# EAGLE design board_v2 (EAGLE 9.0.0)
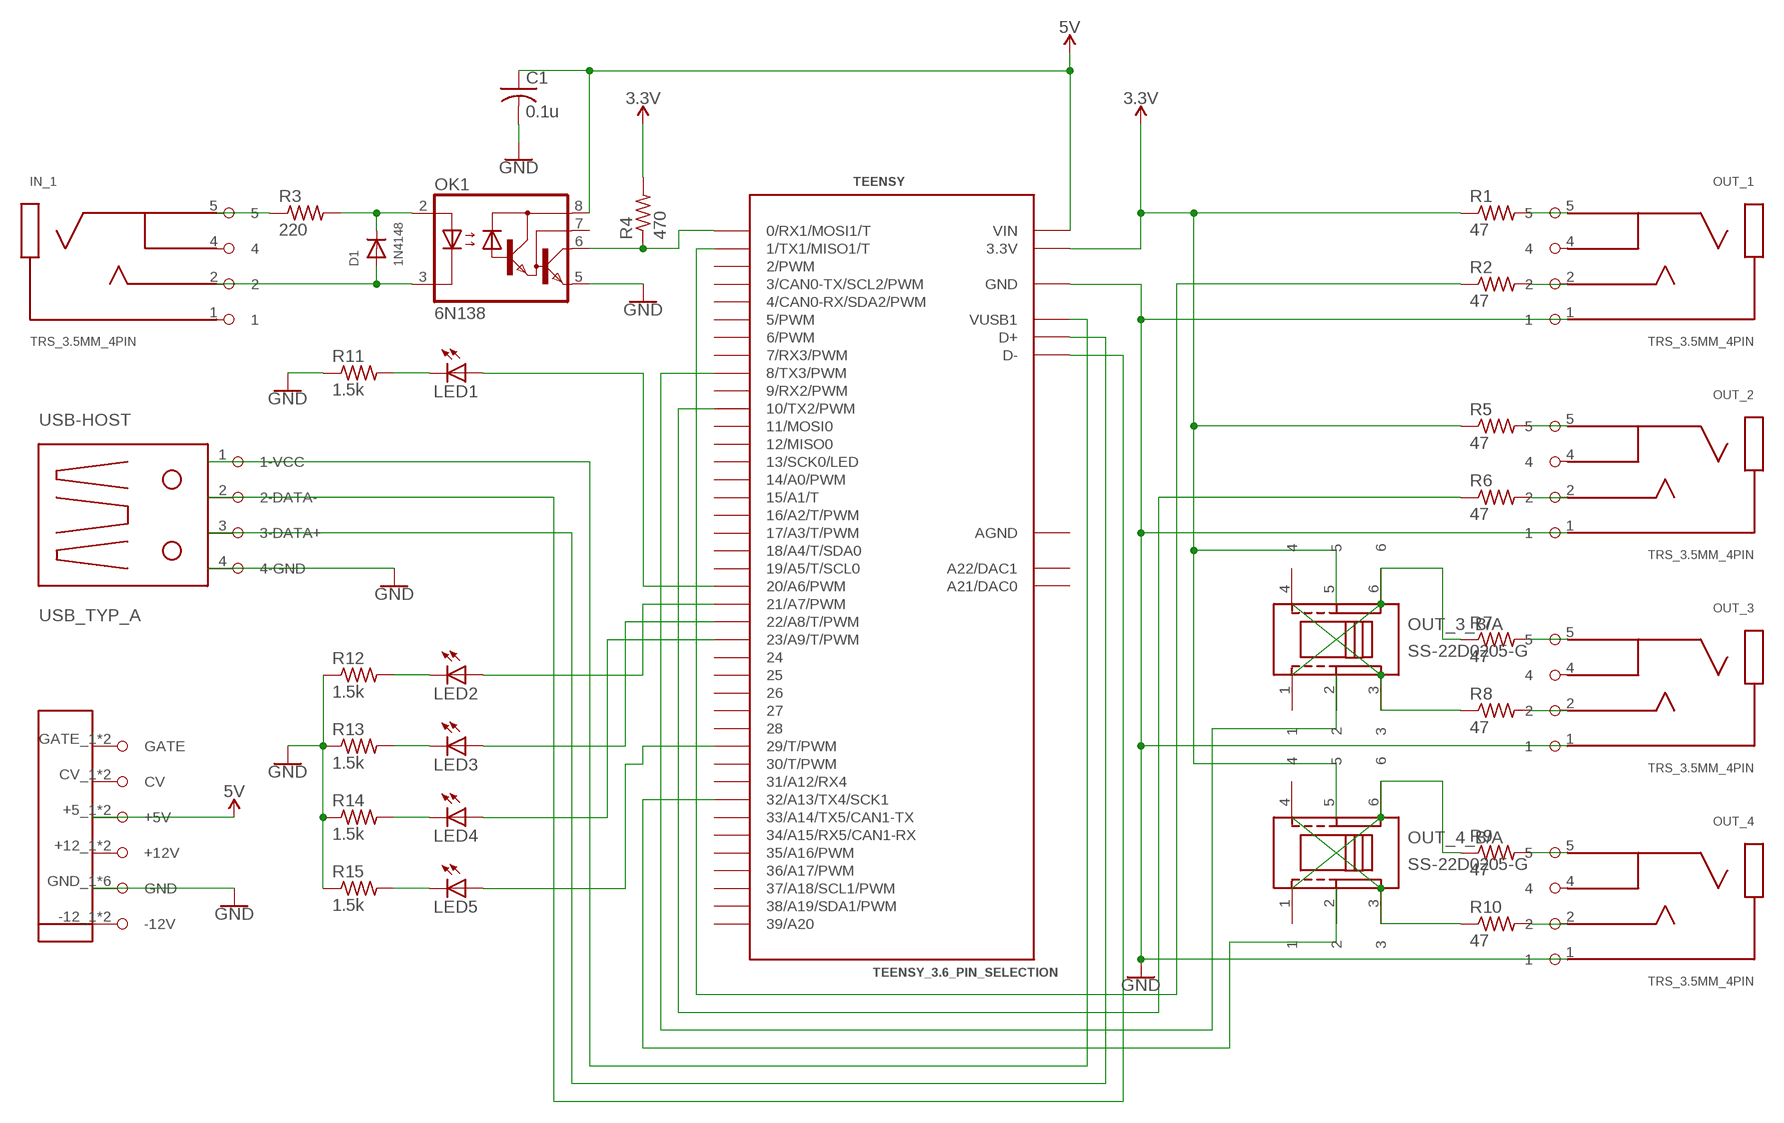
[diagram p0: schematic, sheet 1]

## Parts
C1  0.1u  C-USC0805  [C0805]
D1  1N4148  DIODEDO-1N4148  [DO-1N4148]
IN_1  TRS_3.5MM_4PIN  [FC681374V]
LED1  LED3MM  [LED3MM]
LED2  LED3MM  [LED3MM]
LED3  LED3MM  [LED3MM]
LED4  LED3MM  [LED3MM]
LED5  LED3MM  [LED3MM]
OK1  6N138  [DIL08]
OUT_1  TRS_3.5MM_4PIN  [FC681374V]
OUT_2  TRS_3.5MM_4PIN  [FC681374V]
OUT_3  TRS_3.5MM_4PIN  [FC681374V]
OUT_3_B/A  SS-22D0205-G  [SS-22D0205-G]
OUT_4  TRS_3.5MM_4PIN  [FC681374V]
OUT_4_B/A  SS-22D0205-G  [SS-22D0205-G]
POWER  EURORACK_POWER_16  [EURORACK_POWER_16]
R1  47  R-US_R0805  [R0805]
R2  47  R-US_R0805  [R0805]
R3  220  R-US_R0805  [R0805]
R4  470  R-US_R0805  [R0805]
R5  47  R-US_R0805  [R0805]
R6  47  R-US_R0805  [R0805]
R7  47  R-US_R0805  [R0805]
R8  47  R-US_R0805  [R0805]
R9  47  R-US_R0805  [R0805]
R10  47  R-US_R0805  [R0805]
R11  1.5k  R-US_R0805  [R0805]
R12  1.5k  R-US_R0805  [R0805]
R13  1.5k  R-US_R0805  [R0805]
R14  1.5k  R-US_R0805  [R0805]
R15  1.5k  R-US_R0805  [R0805]
TEENSY  TEENSY_3.6_PIN_SELECTION  [TEENSY_3.6_PIN_SELECTION]
USB-HOST  USB_TYP_A  [USB_HOST_VERTICAL]

## Nets
3.3V: OUT_3_B/A.5 OUT_4_B/A.5 R1.1 R4.2 R5.1 TEENSY.3.3V TEENSY.3.3V3(3.3V)
5V: C1.1 OK1.8(VCC) POWER.+5_1(+5V) POWER.+5_2(+5V) TEENSY.VIN
GND: C1.2 OK1.5(GND) OUT_1.1 OUT_2.1 OUT_3.1 OUT_4.1 POWER.GND_1(GND) POWER.GND_2(GND) POWER.GND_3(GND) POWER.GND_4(GND) POWER.GND_5(GND) POWER.GND_6(GND) R11.1 R12.1 R13.1 R14.1 R15.1 TEENSY.GND TEENSY.GND1(GND) TEENSY.GND3(GND) TEENSY.GND4(GND) USB-HOST.4(4-GND)
N$1: OK1.6(VO) R4.1 TEENSY.0(0/RX1/MOSI1/T)
N$2: D1.C OK1.2(A) R3.2
N$3: D1.A IN_1.2 OK1.3(C)
N$4: TEENSY.VUSB1 USB-HOST.1(1-VCC)
N$5: R2.1 TEENSY.1(1/TX1/MISO1/T)
N$6: OUT_1.2 R2.2
N$7: OUT_1.5 R1.2
N$8: OUT_3.2 R8.2
N$9: IN_1.5 R3.1
N$10: OUT_2.2 R6.2
N$11: OUT_2.5 R5.2
N$12: OUT_3.5 R7.2
N$13: OUT_4.2 R10.2
N$14: OUT_4.5 R9.2
N$15: TEENSY.D+ USB-HOST.3(3-DATA+)
N$16: TEENSY.D- USB-HOST.2(2-DATA-)
N$17: LED1.K(C) R11.2
N$18: R6.1 TEENSY.10(10/TX2/PWM)
N$19: OUT_3_B/A.2 TEENSY.8(8/TX3/PWM)
N$20: OUT_4_B/A.2 TEENSY.32/A13(32/A13/TX4/SCK1)
N$21: OUT_4_B/A.3 OUT_4_B/A.4 R10.1
N$22: LED1.A TEENSY.20/A6(20/A6/PWM)
N$23: OUT_4_B/A.1 OUT_4_B/A.6 R9.1
N$24: OUT_3_B/A.1 OUT_3_B/A.6 R7.1
N$25: OUT_3_B/A.3 OUT_3_B/A.4 R8.1
N$26: LED5.K(C) R15.2
N$27: LED2.K(C) R12.2
N$28: LED3.K(C) R13.2
N$29: LED4.K(C) R14.2
N$30: LED2.A TEENSY.21/A7(21/A7/PWM)
N$31: LED3.A TEENSY.22/A8(22/A8/T/PWM)
N$32: LED4.A TEENSY.23/A9(23/A9/T/PWM)
N$33: LED5.A TEENSY.29(29/T/PWM)
Unconnected: IN_1.1 IN_1.4 OK1.7(VB) OUT_1.4 OUT_2.4 OUT_3.4 OUT_4.4 POWER.+12_1(+12V) POWER.+12_2(+12V) POWER.-12_1(-12V) POWER.-12_2(-12V) POWER.CV_1(CV) POWER.CV_2(CV) POWER.GATE_1(GATE) POWER.GATE_2(GATE) TEENSY.2(2/PWM) TEENSY.3(3/CAN0-TX/SCL2/PWM) TEENSY.4(4/CAN0-RX/SDA2/PWM) TEENSY.5(5/PWM) TEENSY.6(6/PWM) TEENSY.7(7/RX3/PWM) TEENSY.9(9/RX2/PWM) TEENSY.11(11/MOSI0) TEENSY.12(12/MISO0) TEENSY.13(13/SCK0/LED) TEENSY.14/A0(14/A0/PWM) TEENSY.15/A1(15/A1/T) TEENSY.16/A2(16/A2/T/PWM) TEENSY.17/A3(17/A3/T/PWM) TEENSY.18/A4(18/A4/T/SDA0) TEENSY.19/A5(19/A5/T/SCL0) TEENSY.24 TEENSY.25 TEENSY.26 TEENSY.27 TEENSY.28 TEENSY.30(30/T/PWM) TEENSY.31/A12(31/A12/RX4) TEENSY.33/A14(33/A14/TX5/CAN1-TX) TEENSY.34/A15(34/A15/RX5/CAN1-RX) TEENSY.35/A16(35/A16/PWM) TEENSY.36/A17(36/A17/PWM) TEENSY.37/A18(37/A18/SCL1/PWM) TEENSY.38/A19(38/A19/SDA1/PWM) TEENSY.39/A20 TEENSY.A21(A21/DAC0) TEENSY.A22(A22/DAC1)

## Power pins joined to a net without a drawn wire
AGND: TEENSY.AGND

## Library data of the parts
C1 = adafruit:C-US: CAPACITOR, American symbol
D1 = adafruit:DIODE: Diode SMADIODE - SMA Surface Mount Package 20V 1A Schottky Diode Digikey: 641-1014-6-ND DO-1N4148 - Through Hole Small Current Diode SOD-123 20V 1 A (.5mV Vf) Schottky Diode - Digikey: MBRX120TPMSCT-ND SOD-323 10V 570mA (.38mV Vf, 3ns) Schottky Diode - Digikey: ZLLS410CT-ND SOD-523 30V 30mA Schottky Diode (RB751S-40TE61) - Digikey: RB751S-40TE61CT-ND SOT23-R/W - SOT23 Package (R = Solder Paste/Reflow Ovens, W = Hand-Soldering) BAT54Film 40V 300mA - Digikey: 497-7162-1-ND
IN_1 OUT_1-OUT_4 = beat_lbr:TRS_3.5MM_4PIN
LED1-LED5 = adafruit:LED: LED OSRAM: - CHIPLED LG R971, LG N971, LY N971, LG Q971, LY Q971, LO R971, LY R971 LH N974, LH R974 LS Q976, LO Q976, LY Q976 LO Q996 - Hyper CHIPLED LW Q18S LB Q993, LB Q99A, LB R99A - SideLED LS A670, LO A670, LY A670, LG A670, LP A670 LB A673, LV A673, LT A673, LW A673 LH A674 LY A675 LS A676, LA A676, LO A676, LY A676, LW A676 LS A679, LY A679, LG A679 - Hyper Micro SIDELED® LS Y876, LA Y876, LO Y876, LY Y876 LT Y87S - SmartLED LW L88C, LW L88S LB L89C, LB L89S, LG L890 LS L89K, LO L89K, LY L89K LS L896, LA L896, LO L896, LY L896 - TOPLED LS T670, LO T670, LY T670, LG T670, LP T670 LSG T670, LSP T670, LSY T670, LOP T670, LYG T670 LG T671, LOG T671, LSG T671 LB T673, LV T673, LT T673, LW T673 LH T674 LS T676, LA T676, LO T676, LY T676, LB T676, LH T676, LSB T676, LW T676 LB T67C, LV T67C, LT T67C, LS T67K, LO T67K, LY T67K, LW E67C LS E67B, LA E67B, LO E67B, LY E67B, LB E67C, LV E67C, LT E67C LW T67C LS T679, LY T679, LG T679 LS T770, LO T770, LY T770, LG T770, LP T770 LB T773, LV T773, LT T773, LW T773 LH T774 LS E675, LA E675, LY E675, LS T675 LS T776, LA T776, LO T776, LY T776, LB T776 LHGB T686 LT T68C, LB T68C - Hyper Mini TOPLED® LB M676 - Mini TOPLED Santana® LG M470 LS M47K, LO M47K, LY M47K Source: http://www.osram.convergy.de/
OK1 = optocoupler:6N138: MOTOROLA OPTO COUPLER; MF: VISHAY/TELEFUNKEN; MPN: 6N138; OC_FARNELL: 9860150; OC_NEWARK: 35K5294
OUT_3_B/A OUT_4_B/A = beat_lbr:SS-22D0205-G
POWER = beat_lbr:EURORACK_POWER_16
R1-R15 = adafruit:R-US_: RESISTOR, American symbol
TEENSY = Teensy_3_and_LC_Series_Boards_v1.4:TEENSY_3.6_PIN_SELECTION
USB-HOST = beat_lbr:USB_TYP_A

## Board
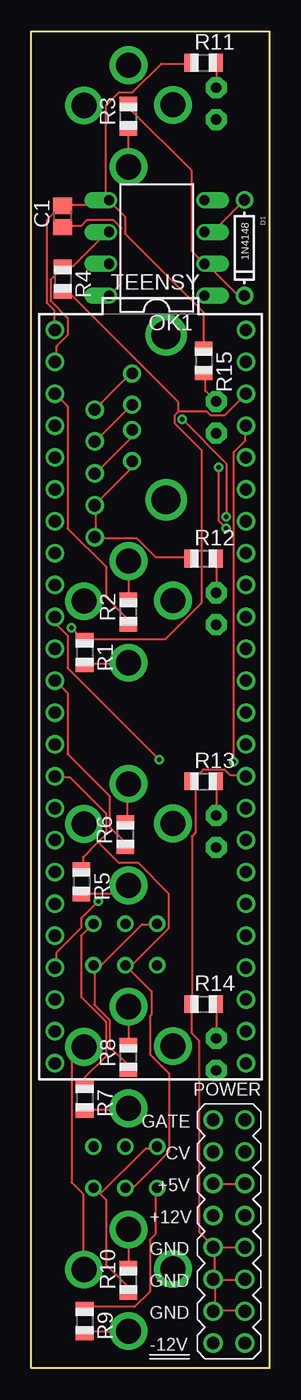
[diagram p1: board, top side]
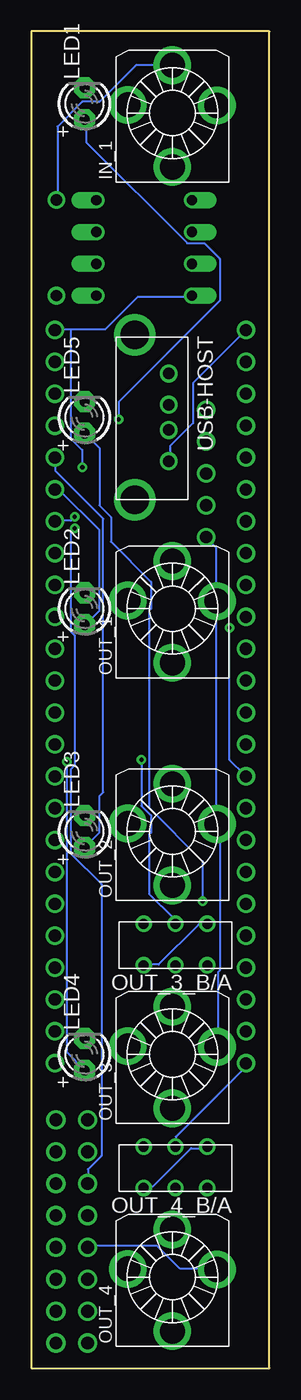
[diagram p2: board, bottom side, seen from below]

Size 19 x 106.5 mm. Coordinates in mm from the lower left corner, seen from the top.
Outline: 0,0 0,106.5 19,106.5 19,0 0,0
Copper layers (1*16): Top 0.035mm / dielectric 1.5mm / Bottom 0.035mm
Design rules "default": minimum track width 6mil, minimum drill 0.35mm, track to track 6mil, track to pad 6mil, pad to pad 6mil, via to via 6mil, smd to smd 6mil, copper to edge 40mil, drill to drill 6mil, minimum pad ring 10mil, minimum via ring 8mil, stop-mask expansion 4mil, vias tented up to drill 0mil, thermal gap 10mil

### Footprints (pad centres in the part's own frame; a part is rotated, then mirrored left to right if it is on the bottom)
C0805 = smd 1.3 x 1.5: 1 -0.85,0; 2 0.85,0
DO-1N4148 = drill 0.9: A -3.81,0; C 3.81,0
FC681374V = drill 2: 1 3.55,0.6; 2 0,3.8; 4 -3.55,0.65; 5 0,-4.3
LED3MM = drill 0.813 pad 1.676 octagon: A -1.27,0; K 1.27,0
DIL08 = drill 0.813 offset: 1 -3.81,-3.81; 2 -1.27,-3.81; 3 1.27,-3.81; 4 3.81,-3.81; 5 3.81,3.81; 6 1.27,3.81; 7 -1.27,3.81; 8 -3.81,3.81
SS-22D0205-G = drill 0.8: 1 -2.54,-1.65; 2 0,-1.65; 3 2.54,-1.65; 4 -2.54,1.65; 5 0,1.65; 6 2.54,1.65
EURORACK_POWER_16 = drill 1.02: +5_1 0,12.7; +5_2 2.54,12.7; +12_1 0,10.16; +12_2 2.54,10.16; -12_1 0,0; -12_2 2.54,0; CV_1 0,15.24; CV_2 2.54,15.24; GATE_1 0,17.78; GATE_2 2.54,17.78; GND_1 0,2.54; GND_2 2.54,2.54; GND_3 0,5.08; GND_4 2.54,5.08; GND_5 0,7.62; GND_6 2.54,7.62
R0805 = smd 1.1 x 1.4: 1 -1,0; 2 1,0
TEENSY_3.6_PIN_SELECTION = drill 0.965: 0 -7.62,25.4; 1 -7.62,22.86; 2 -7.62,20.32; 3 -7.62,17.78; 3.3V 7.62,22.86; 3.3V3 -7.62,-7.62; 4 -7.62,15.24; 5 -7.62,12.7; 6 -7.62,10.16; 7 -7.62,7.62; 8 -7.62,5.08; 9 -7.62,2.54; 10 -7.62,0; 11 -7.62,-2.54; 12 -7.62,-5.08; 13 7.62,-5.08; 14/A0 7.62,-2.54; 15/A1 7.62,0; 16/A2 7.62,2.54; 17/A3 7.62,5.08; 18/A4 7.62,7.62; 19/A5 7.62,10.16; 20/A6 7.62,12.7; 21/A7 7.62,15.24; 22/A8 7.62,17.78; 23/A9 7.62,20.32; 24 -7.62,-10.16; 25 -7.62,-12.7; 26 -7.62,-15.24; 27 -7.62,-17.78; 28 -7.62,-20.32; 29 -7.62,-22.86; 30 -7.62,-25.4; 31/A12 -7.62,-27.94; 32/A13 -7.62,-30.48; 33/A14 7.62,-30.48; 34/A15 7.62,-27.94; 35/A16 7.62,-25.4; 36/A17 7.62,-22.86; 37/A18 7.62,-20.32; 38/A19 7.62,-17.78; 39/A20 7.62,-15.24; A21 7.62,-12.7; A22 7.62,-10.16; AGND 7.62,25.4; D+ -4.445,16.51; D- -4.445,19.05; GND -7.62,27.94; GND1 7.62,-7.62; GND3 -4.445,13.97; GND4 -4.445,11.43; VIN 7.62,27.94; VUSB1 -4.445,21.59
USB_HOST_VERTICAL = drill 0.92: 1 -3.5,2.71; 2 -1,2.71; 3 1,2.71; 4 3.5,2.71 | drill 2.3: VIA1 -6.57,0; VIA2 6.57,0

### Placement (x,y rotation side)
C1  2.5,91.75 90 top
D1  17,89.25 270 top
IN_1  7.75,100 0 bottom
LED1  14.75,100.75 90 bottom
LED2  14.75,60.5 90 bottom
LED3  14.75,42.75 90 bottom
LED4  14.75,25 90 bottom
LED5  14.75,75.75 90 bottom
OK1  10,89.25 90 top
OUT_1  7.75,60.5 0 bottom
OUT_2  7.75,42.75 0 bottom
OUT_3  7.75,25 0 bottom
OUT_3_B/A  7.5,33.75 180 bottom
OUT_4  7.75,7.25 0 bottom
OUT_4_B/A  7.5,16 180 bottom
POWER  14.5,2 0 top
R1  4.25,57 270 top
R2  7.75,60.25 90 top
R3  7.75,99.75 90 top
R4  2.5,86.75 270 top
R5  4,38.75 270 top
R6  7.5,42.5 90 top
R7  4.25,21.5 270 top
R8  7.75,24.75 90 top
R9  4.25,3.75 270 top
R10  7.75,7 90 top
R11  13.75,104 0 top
R12  13.75,64.5 0 top
R13  13.75,46.75 0 top
R14  13.75,29 0 top
R15  13.75,80.25 270 top
TEENSY  9.5,54.77 0 top
USB-HOST  10.75,75.75 270 bottom

### Tracks (layer width: path | path; a pad name or v marks a point on that pad's centre or on a via)
3.3V  (via drill 0.35)
  Top 0.152: 11.73,76.2 11.43,75.89 11.43,75.29 13.56,73.15 13.56,60.96 10.67,58.06 4.27,58.06 R1.1 4.12,58.06 v3.2,58.98 | 11.73,76.2 14.02,76.2 14.33,75.89 15.39,75.89 17.07,77.57 TEENSY.3.3V | 11.73,76.2 11.73,76.96 3.05,85.65 2.59,85.65 R4.2 | 5.33,41.91 5.94,42.52 5.94,44.2 3.05,47.09 1.98,47.09 TEENSY.3.3V3 | 5.33,41.91 4.12,40.69 4.12,39.78 R5.1 | 7.77,31.85 7.62,32 OUT_3_B/A.5 7.77,31.85 | 7.77,31.85 9.6,30.02 9.6,28.19 9.45,28.04 9.45,24.99 10.97,23.47 10.97,17.22 8.23,14.48 7.62,14.48 OUT_4_B/A.5 | 5.33,41.91 7.01,40.23 8.53,40.23 10.97,37.8 10.97,35.05 7.77,31.85
  Bottom 0.152: v3.2,58.98 3.2,48.46 1.98,47.24 TEENSY.3.3V3
5V  (via drill 0.35)
  Top 0.152: POWER.+5_1 14.63,14.63 16.92,14.63 POWER.+5_2 | C1.1 2.59,90.98 3.96,90.98 4.42,91.44 6.55,91.44 7.16,90.83 7.16,86.41 6.25,85.5 OK1.8 | v15.54,66.9 14.94,67.51 v14.94,71.78
  Bottom 0.152: 15.85,82.75 13.11,82.75 10.52,85.34 6.25,85.34 OK1.8 | 15.85,82.75 17.07,82.75 TEENSY.VIN | v15.54,66.9 15.85,66.6 15.85,58.67 15.54,58.37 15.54,48.01 15.85,47.7 15.85,41 13.41,38.56 13.41,16.92 14.48,15.85 14.48,14.78 POWER.+5_1 | v14.94,71.78 14.94,73.15 15.85,74.07 15.85,82.75
GND
  Top 0.152: TEENSY.GND1 17.07,47.24 15.85,47.24 15.39,47.7 13.72,47.7 12.8,46.79 R13.1 12.8,46.63 13.11,46.33 13.11,42.67 12.8,42.37 12.8,29.11 R14.1 12.8,28.96 12.8,26.67 13.41,26.06 13.41,10.82 14.48,9.75 POWER.GND_5 14.63,9.6 | 14.63,9.6 16.92,9.6 POWER.GND_6 | 14.63,4.57 16.92,4.57 POWER.GND_2 | 14.63,7.01 16.92,7.01 POWER.GND_4 | 14.63,7.01 14.63,4.57 | 14.63,4.57 POWER.GND_1 | 14.63,7.01 POWER.GND_3 14.63,7.16 14.63,9.6 | USB-HOST.4 7.92,72.24 7.92,71.63 5.18,68.89 TEENSY.GND3 5.18,68.73 5.18,66.29 TEENSY.GND4 5.18,66.14 8.38,66.14 9.91,64.62 12.65,64.62 R12.1 | R15.1 13.72,81.38 13.72,84.12 7.47,90.37 7.47,91.75 6.25,92.96 OK1.5 | R11.1 12.65,103.94 10.36,103.94 8.08,101.65 7.01,101.65 5.94,100.58 5.94,93.27 6.1,93.12 OK1.5 | OK1.5 6.1,92.96 5.79,92.66 2.59,92.66 C1.2 2.44,92.66 1.22,91.44 1.22,84.89 1.83,84.28 1.83,82.75 TEENSY.GND | OUT_4.1 4.12,7.92 4.12,13.87 3.2,14.78 3.2,24.54 4.12,25.45 OUT_3.1
  Bottom 0.152: POWER.GND_5 14.48,9.75 8.99,9.75 7.16,7.92 4.27,7.92 OUT_4.1 | OUT_3.1 4.12,25.6 4.12,31.55 3.96,31.7 3.96,43.13 4.12,43.28 OUT_2.1 4.27,43.43 4.27,60.96 OUT_1.1 4.27,61.11 4.27,65.38 5.03,66.14 TEENSY.GND4 | USB-HOST.4 7.92,72.39 7.92,73.46 6.1,75.29 6.1,78.49 1.98,82.6 TEENSY.GND
N$1
  Top 0.152: OK1.6 6.1,90.53 3.35,87.78 2.59,87.78 R4.1 2.44,87.63 1.52,86.72 1.52,85.04 2.9,83.67 2.9,82.3 1.98,81.38 1.98,80.31 TEENSY.0
N$2
  Top 0.152: R3.2 7.77,100.74 7.77,100.43 12.8,95.4 12.8,89 13.72,88.09 OK1.2 13.87,88.09 16.46,85.5 16.92,85.5 D1.C
N$3
  Top 0.152: OK1.3 13.87,90.53 14.48,90.53 16.92,92.96 D1.A
  Bottom 0.152: D1.A 16.92,93.12 16.92,98.91 14.94,100.89 13.56,100.89 10.67,103.78 7.77,103.78 IN_1.2
N$4
  Top 0.152: USB-HOST.1 7.92,79.25 5.18,76.5 TEENSY.VUSB1
N$5
  Top 0.152: R2.1 7.62,59.28 7.62,59.74 5.94,61.42 5.94,63.86 2.9,66.9 2.9,76.66 1.98,77.57 TEENSY.1
N$6
  Top 0.152: R2.2 7.77,61.27 7.77,64.16 OUT_1.2
N$7
  Top 0.152: R1.2 4.27,56.08 7.62,56.08 OUT_1.5
N$8
  Top 0.152: R8.2 7.77,25.76 7.77,28.65 OUT_3.2
N$9
  Top 0.152: R3.1 7.77,98.6 7.77,95.71 IN_1.5
N$10
  Top 0.152: R6.2 7.62,43.59 7.62,46.48 OUT_2.2
N$11
  Top 0.152: R5.2 4.12,37.8 7.01,37.8 7.62,38.41 OUT_2.5
N$12
  Top 0.152: R7.2 4.27,20.57 7.62,20.57 OUT_3.5
N$13
  Top 0.152: R10.2 7.77,8.08 7.77,10.97 OUT_4.2
N$14
  Top 0.152: R9.2 4.27,2.9 7.62,2.9 OUT_4.5
N$15
  Top 0.152: USB-HOST.3 7.92,74.68 7.92,74.07 5.18,71.32 TEENSY.D+
N$16
  Top 0.152: USB-HOST.2 7.92,76.66 5.18,73.91 TEENSY.D-
N$17
  Top 0.152: R11.2 14.78,103.94 14.78,102.11 LED1.K
N$18
  Top 0.152: R6.1 7.47,41.6 7.47,41.91 6.25,43.13 6.25,45.57 2.9,48.92 2.9,53.8 1.98,54.71 TEENSY.10
N$19  (via drill 0.35)
  Top 0.152: v10.21,48.46 2.9,55.78 2.9,58.37 1.98,59.28 1.98,59.74 TEENSY.8
  Bottom 0.152: v10.21,48.46 10.21,44.81 9.45,44.04 9.45,42.67 9.6,42.52 9.6,37.8 7.62,35.81 7.62,35.51 OUT_3_B/A.2
N$20
  Bottom 0.152: OUT_4_B/A.2 7.47,17.68 7.47,18.44 1.98,23.93 1.98,24.23 TEENSY.32/A13
N$21
  Top 0.152: 5.49,13.87 5.03,14.33 OUT_4_B/A.4 | 5.49,13.87 5.94,13.41 5.94,8.23 7.62,6.55 7.62,6.1 R10.1 | 5.49,13.87 9.14,17.53 9.91,17.53 OUT_4_B/A.3
N$22  (via drill 0.35)
  Top 0.152: v15.54,67.82 15.54,72.08 v12.04,75.59
  Bottom 0.152: v15.54,67.82 15.85,67.51 17.07,67.51 TEENSY.20/A6 | v12.04,75.59 12.04,76.96 3.96,85.04 3.96,88.39 5.18,89.61 6.55,89.61 14.63,97.69 14.63,99.36 LED1.A
N$23
  Top 0.152: R9.1 4.27,4.88 8.23,4.88 9.45,6.1 9.45,10.21 9.91,10.67 9.91,14.33 OUT_4_B/A.6
  Bottom 0.152: OUT_4_B/A.1 5.03,17.53 6.25,17.53 9.3,14.48 9.91,14.48 OUT_4_B/A.6
N$24
  Top 0.152: R7.1 4.27,22.55 4.27,23.16 5.94,24.84 5.94,27.58 3.96,29.57 3.96,34.44 4.88,35.36 OUT_3_B/A.1
  Bottom 0.152: OUT_3_B/A.6 9.91,32.16 8.84,32.16 5.64,35.36 5.03,35.36 OUT_3_B/A.1
N$25
  Top 0.152: R8.1 7.62,23.77 7.62,24.23 6.25,25.6 6.25,27.74 5.03,28.96 5.03,32 OUT_3_B/A.4 5.03,32.16 5.64,32.16 8.84,35.36 9.91,35.36 OUT_3_B/A.3
N$26
  Top 0.152: R15.2 13.87,79.25 13.87,77.88 14.63,77.11 LED5.K
N$27
  Top 0.152: R12.2 14.78,64.47 14.78,61.87 LED2.K
N$28
  Top 0.152: R13.2 14.78,46.63 14.78,44.04 LED3.K
N$29
  Top 0.152: R14.2 14.78,28.96 14.78,26.36 LED4.K
N$30
  Bottom 0.152: TEENSY.21/A7 17.07,69.95 16.76,69.95 13.56,66.75 13.56,60.35 14.63,59.28 LED2.A
N$31
  Bottom 0.152: TEENSY.22/A8 17.07,72.54 17.07,71.48 13.26,67.67 13.26,45.87 13.56,45.57 13.56,42.67 14.63,41.6 LED3.A
N$32  (via drill 0.35)
  Top 0.152: v16.15,48.31 16.15,73 17.07,73.91 17.07,74.98 TEENSY.23/A9
  Bottom 0.152: v16.15,48.31 16.15,25.15 14.78,23.77 LED4.A
N$33  (via drill 0.35)
  Top 0.152: v5.33,37.19 3.96,35.81 3.96,35.05 1.98,33.07 1.98,32 TEENSY.29
  Bottom 0.152: v5.33,37.19 5.33,40.39 9.6,44.65 9.6,60.35 9.45,60.5 9.45,62.64 12.65,65.84 12.65,67.82 13.56,68.73 13.56,73.3 14.63,74.37 LED5.A